# Altium schematic sheet GPIO.SchDoc: DARKYDEN_GPIO
size Letter; ApprovedBy: APPROUVÉ PAR; Author: Harold Malbrouck; Organization: Cegep Limoilou; Address1: 1300, 8e Avenue; Address2: Québec, QC; Address3: Canada; Address4: G1J 5L5; Revision: Rev.A; SheetNumber: 4; SheetTotal: 21
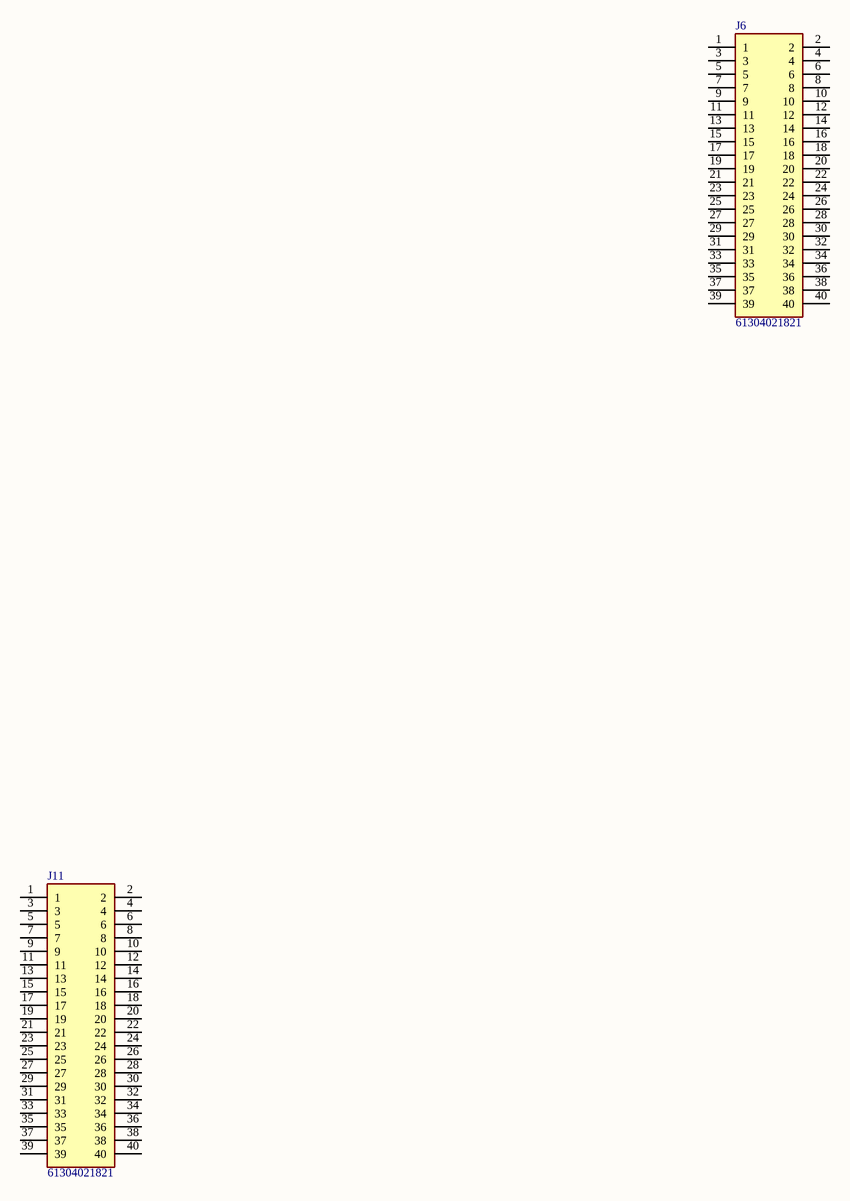
[diagram p0: GPIO.SchDoc]

## Parts
J6  61304021821  [RHDR40W97P254X254_2X20_5130X508X860P]
J11  61304021821  [RHDR40W97P254X254_2X20_5130X508X860P]

## Nets

Not connected (* = marked no-connect by the designer): J6 1 2 3 4 5 6 7 8 9 10 11 12 13 14 15 16 17 18 19 20 21 22 23 24 25 26 27 28 29 30 31 32 33 34 35 36 37 38 39 40; J11 1 2 3 4 5 6 7 8 9 10 11 12 13 14 15 16 17 18 19 20 21 22 23 24 25 26 27 28 29 30 31 32 33 34 35 36 37 38 39 40

## Notes on the sheet
- Titre :
- Conception :
- Date :
- Approbation :
- Heure :
- Révision :
- Feuille
- de
- Fichier :

## Library data of the parts
J6 J11 = 61304021821: Connector; Manufacturer_Name: Wurth Elektronik; Datasheet Link: https://componentsearchengine.com/Datasheets/1/61304021821.pdf; Height: 8.6mm; Manufacturer_Part_Number: 61304021821; Mouser Part Number: 710-61304021821; Mouser Price/Stock: https://www.mouser.co.uk/ProductDetail/Wurth-Elektronik/61304021821?qs=bZr6mbWTK5mzEvTTGhcEyQ%3D%3D